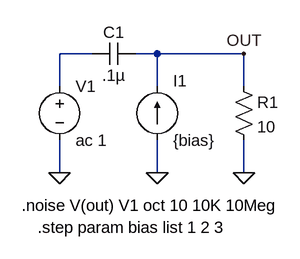
[diagram p0: schematic NoiseStep.asc]
NoiseStep.asc, the LTspice schematic file:
Version 4
SHEET 1 880 680
WIRE 272 336 272 288
WIRE 272 208 272 160
WIRE 272 160 144 160
WIRE 144 160 144 208
WIRE 144 288 144 336
WIRE 48 160 0 160
WIRE 144 160 112 160
WIRE 0 160 0 208
WIRE 0 288 0 336
FLAG 144 336 0
FLAG 272 336 0
FLAG 0 336 0
FLAG 272 160 OUT
SYMBOL current 144 288 M180
WINDOW 0 24 88 Left 0
WINDOW 3 24 0 Left 0
WINDOW 123 0 0 Left 0
WINDOW 39 0 0 Left 0
SYMATTR InstName I1
SYMATTR Value {bias}
SYMBOL res 256 192 R0
SYMATTR InstName R1
SYMATTR Value 10
SYMBOL cap 112 144 R90
WINDOW 0 0 32 VBottom 0
WINDOW 3 32 32 VTop 0
SYMATTR InstName C1
SYMATTR Value .1µ
SYMBOL voltage 0 192 R0
SYMATTR InstName V1
SYMATTR Value ac 1
TEXT -32 416 Left 0 !.step param bias list 1 2 3
TEXT -56 384 Left 0 !.noise V(out) V1 oct 10 10K 10Meg

The netlist it stands for:
* NoiseStep.asc
I1 0 OUT {bias}
R1 OUT 0 10
C1 OUT N001 .1µ
V1 N001 0 ac 1
.step param bias list 1 2 3
.noise V(out) V1 oct 10 10K 10Meg
.backanno
.end